# EAGLE schematic DNVT_box3rt (EAGLE 9.6.2)

## Sheet 1 of 3
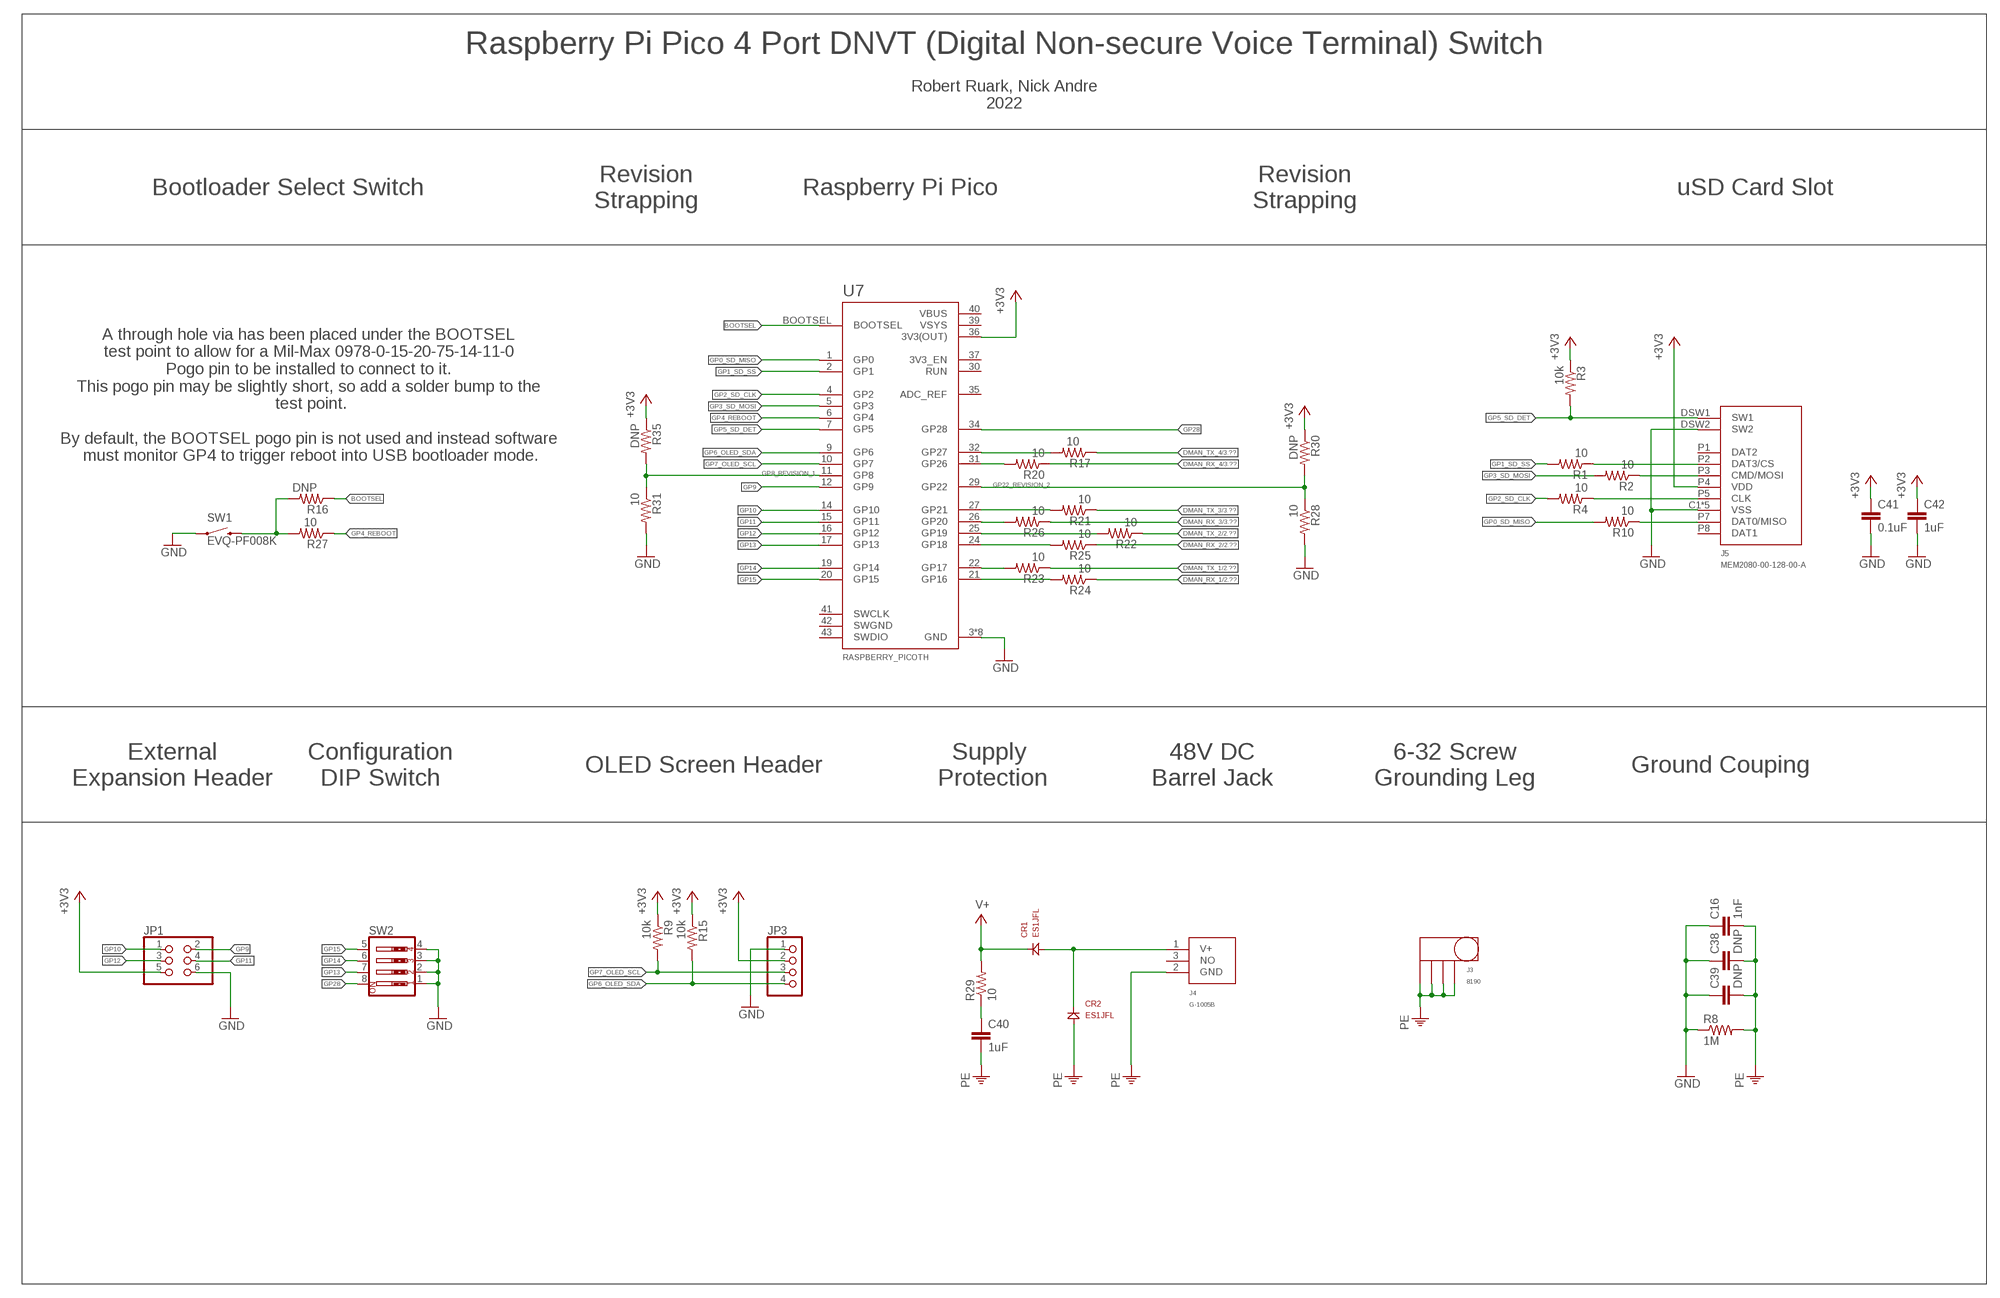
[diagram p0: schematic, sheet 1]

### Parts
C16  1nF  1206_CAPACITOR  [1206]
C38  DNP  1206_CAPACITOR  [1206]
C39  DNP  1206_CAPACITOR  [1206]
C40  1uF  1206_CAPACITOR  [1206]
C41  0.1uF  0603_CAPACITOR  [0603]
C42  1uF  0805_CAPACITOR  [0805]
CR1  ES1JFL  [SOD123(AK)]
CR2  ES1JFL  [SOD123(AK)]
J3  8190  [7781]
J4  G-1005B  [G-1005B]
J5  MEM2080-00-128-00-A  [MEM2080]
JP1  PINHD-2X3/90  [2X03/90]
JP3  PINHD-1X4  [1X04]
R1  10  0603_RESISTOR  [0603]
R2  10  0603_RESISTOR  [0603]
R3  10k  0603_RESISTOR  [0603]
R4  10  0603_RESISTOR  [0603]
R8  1M  1206_RESISTOR  [1206]
R9  10k  0603_RESISTOR  [0603]
R10  10  0603_RESISTOR  [0603]
R15  10k  0603_RESISTOR  [0603]
R16  DNP  0603_RESISTOR  [0603]
R17  10  0603_RESISTOR  [0603]
R20  10  0603_RESISTOR  [0603]
R21  10  0603_RESISTOR  [0603]
R22  10  0603_RESISTOR  [0603]
R23  10  0603_RESISTOR  [0603]
R24  10  0603_RESISTOR  [0603]
R25  10  0603_RESISTOR  [0603]
R26  10  0603_RESISTOR  [0603]
R27  10  0603_RESISTOR  [0603]
R28  10  0603_RESISTOR  [0603]
R29  10  1206_RESISTOR  [1206]
R30  DNP  0603_RESISTOR  [0603]
R31  10  0603_RESISTOR  [0603]
R35  DNP  0603_RESISTOR  [0603]
SW1  EVQ-PF008K  [EVQ-PF008K]
SW2  SW_DIP-4  [EDG-04]
U7  RASPBERRY_PICOTH  [PICO-PKG-TH]

### Nets
+3V3: C41.1 C42.1 J5.P4(VDD) JP1.5 JP3.2 R3.1 R9.1 R15.1 R30.1 R35.1 U7.36(3V3(OUT)) ; also sheet 2,3
BOOTSEL: R16.1 U7.BOOTSEL
DMAN_RX_1: R24.1 ; also sheet 2
DMAN_RX_2: R25.1 ; also sheet 2
DMAN_RX_3: R26.1 ; also sheet 3
DMAN_RX_4: R20.1 ; also sheet 3
DMAN_TX_1: R23.1 ; also sheet 2
DMAN_TX_2: R22.1 ; also sheet 2
DMAN_TX_3: R21.1 ; also sheet 3
DMAN_TX_4: R17.1 ; also sheet 3
GND: C16.1 C38.1 C39.1 C41.2 C42.2 J5.C1(VSS) J5.C2(VSS) J5.C3(VSS) J5.C4(VSS) J5.DSW2(SW2) J5.P6(VSS) JP1.6 JP3.1 R8.1 R28.2 R31.2 SW1.S1 SW2.1 SW2.2 SW2.3 SW2.4 U7.3(GND) U7.8(GND) U7.13(GND) U7.18(GND) U7.23(GND) U7.28(GND) U7.33(GND) U7.38(GND) ; also sheet 2,3
GP0_SD_MISO: R10.2 U7.1(GP0)
GP1_SD_SS: R1.2 U7.2(GP1)
GP2_SD_CLK: R4.2 U7.4(GP2)
GP3_SD_MOSI: R2.2 U7.5(GP3)
GP4_REBOOT: R27.1 U7.6(GP4)
GP5_SD_DET: J5.DSW1(SW1) R3.2 U7.7(GP5)
GP6_OLED_SDA: JP3.4 R15.2 U7.9(GP6)
GP7_OLED_SCL: JP3.3 R9.2 U7.10(GP7)
GP8_REVISION_1: R31.1 R35.2 U7.11(GP8)
GP9: JP1.2 U7.12(GP9)
GP10: JP1.1 U7.14(GP10)
GP11: JP1.4 U7.15(GP11)
GP12: JP1.3 U7.16(GP12)
GP13: SW2.7 U7.17(GP13)
GP14: SW2.6 U7.19(GP14)
GP15: SW2.5 U7.20(GP15)
GP22_REVISION_2: R28.1 R30.2 U7.29(GP22)
GP28: SW2.8 U7.34(GP28)
N$7: R20.2 U7.31(GP26)
N$13: R17.2 U7.32(GP27)
N$17: R24.2 U7.21(GP16)
N$18: R23.2 U7.22(GP17)
N$19: R16.2 R27.2 SW1.S2
N$20: CR1.A CR2.K J4.1(V+)
N$21: R25.2 U7.24(GP18)
N$22: R22.2 U7.25(GP19)
N$23: R21.2 U7.27(GP21)
N$24: R26.2 U7.26(GP20)
N$25: J5.P5(CLK) R4.1
N$27: C40.1 R29.1
N$28: J5.P7(DAT0/MISO) R10.1
N$30: J5.P3(CMD/MOSI) R2.1
N$31: J5.P2(DAT3/CS) R1.1
PE: C16.2 C38.2 C39.2 C40.2 CR2.A J3.P$1 J3.P$2 J3.P$3 J3.P$4 J4.2(GND) R8.2 ; also sheet 2,3
V+: CR1.K R29.2 ; also sheet 2,3
Unconnected: J4.3(NO) J5.P1(DAT2) J5.P8(DAT1) U7.30(RUN) U7.35(ADC_REF) U7.37(3V3_EN) U7.41(SWCLK) U7.43(SWDIO)

### Notes on the sheet
- Raspberry Pi Pico 4 Port DNVT (Digital Non-secure Voice Terminal) Switch
- Robert Ruark, Nick Andre
  2022
- Bootloader Select Switch
- Revision
  Strapping
- Raspberry Pi Pico
- Revision
  Strapping
- uSD Card Slot
- A through hole via has been placed under the BOOTSEL 
  test point to allow for a Mil-Max 0978-0-15-20-75-14-11-0 
  Pogo pin to be installed to connect to it. 
  This pogo pin may be slightly short, so add a solder bump to the 
  test point.
  
  By default, the BOOTSEL pogo pin is not used and instead software 
  must monitor GP4 to trigger reboot into USB bootloader mode.
- External
  Expansion Header
- Configuration
  DIP Switch
- OLED Screen Header
- Supply 
  Protection
- 48V DC
  Barrel Jack
- 6-32 Screw
  Grounding Leg
- Ground Couping

## Sheet 2 of 3
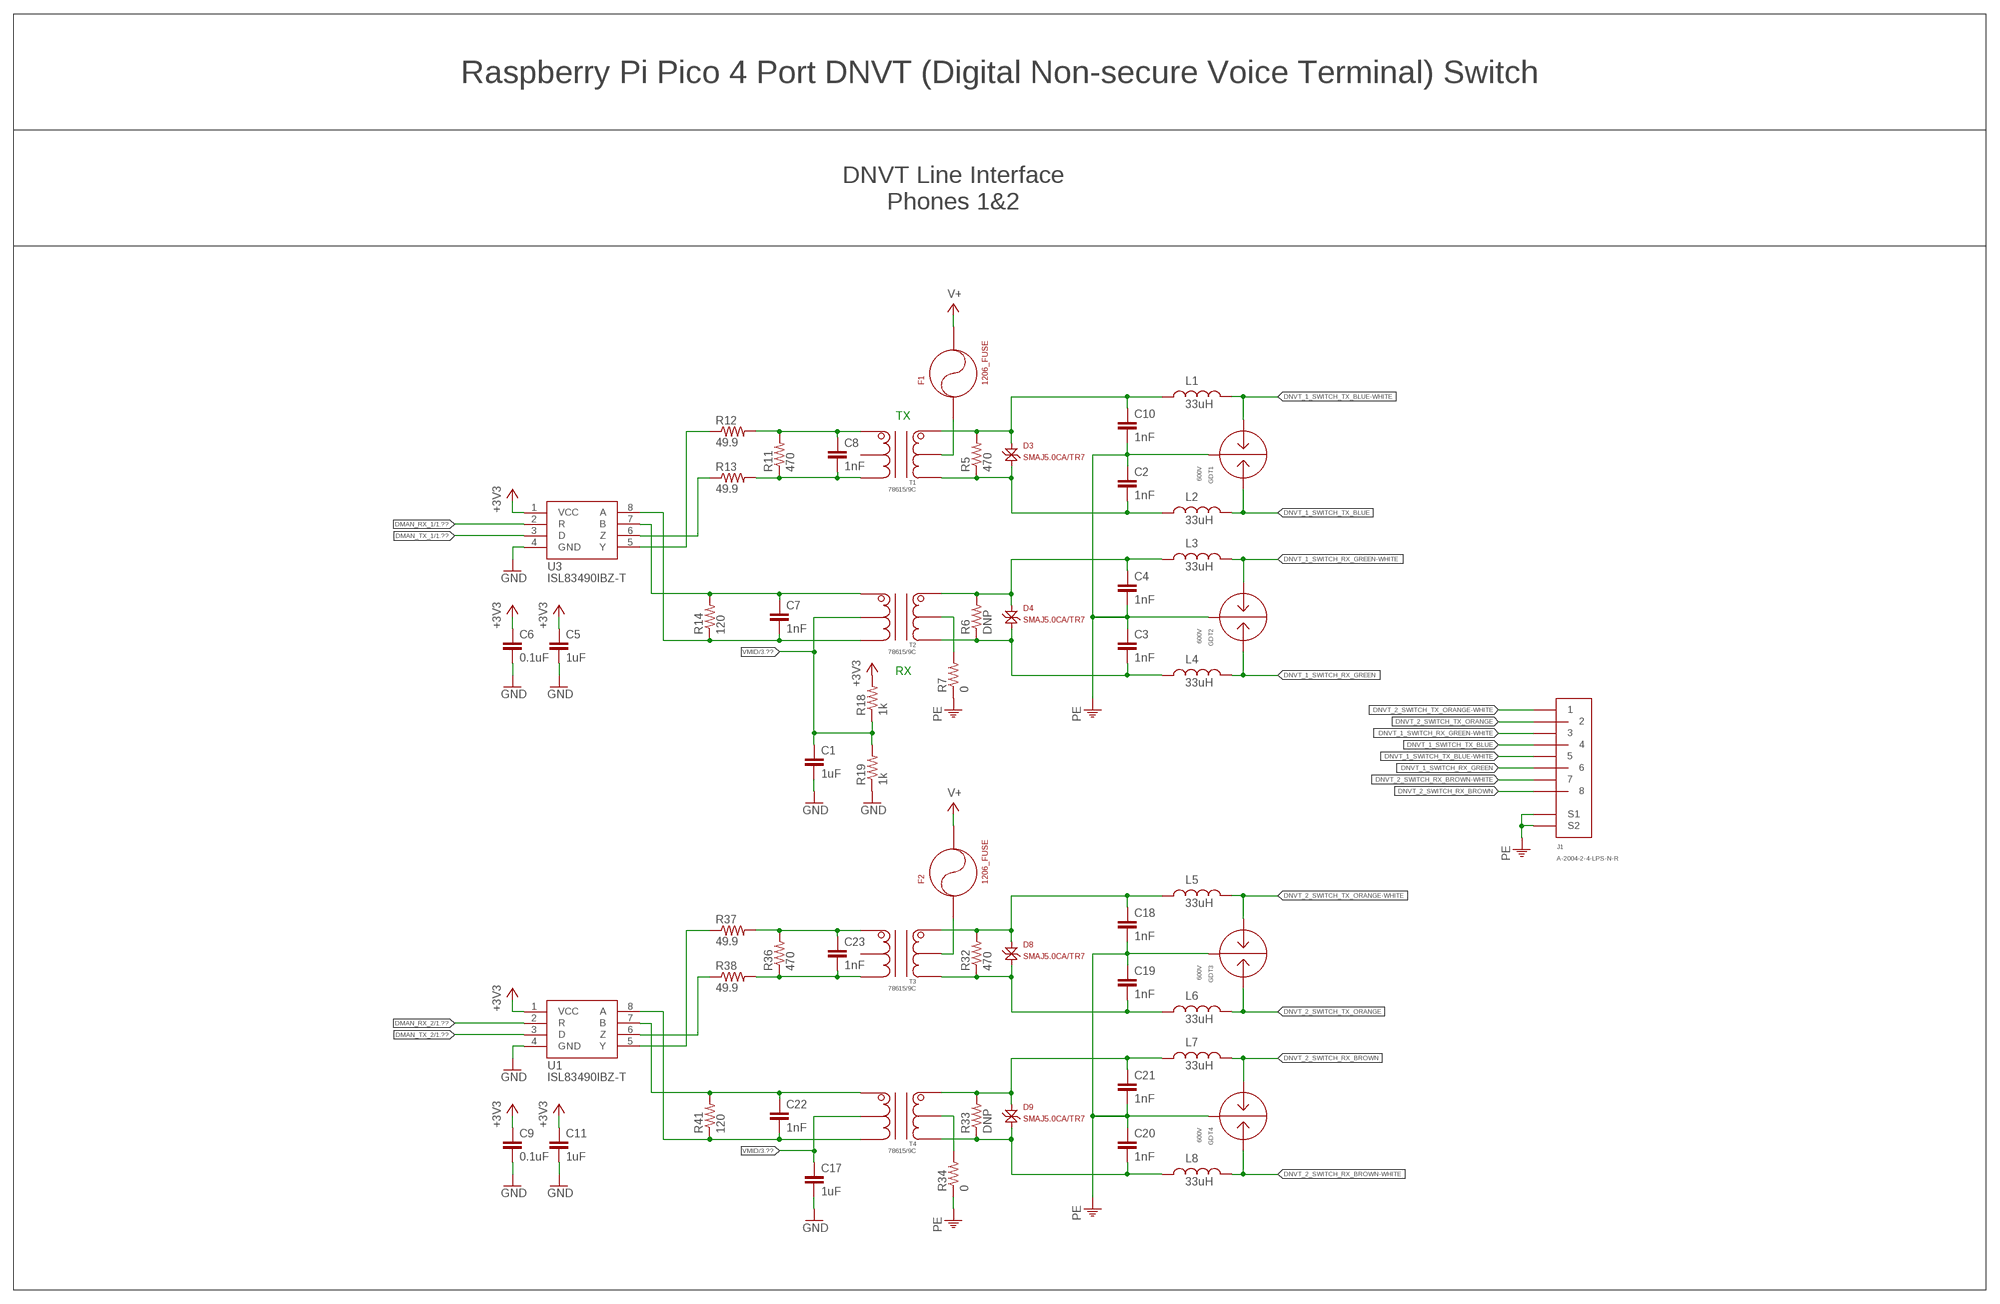
[diagram p1: schematic, sheet 2]

### Parts
C1  1uF  0805_CAPACITOR  [0805]
C2  1nF  0805_CAPACITOR  [0805]
C3  1nF  0805_CAPACITOR  [0805]
C4  1nF  0805_CAPACITOR  [0805]
C5  1uF  0805_CAPACITOR  [0805]
C6  0.1uF  0603_CAPACITOR  [0603]
C7  1nF  0805_CAPACITOR  [0805]
C8  1nF  0805_CAPACITOR  [0805]
C9  0.1uF  0603_CAPACITOR  [0603]
C10  1nF  0805_CAPACITOR  [0805]
C11  1uF  0805_CAPACITOR  [0805]
C17  1uF  0805_CAPACITOR  [0805]
C18  1nF  0805_CAPACITOR  [0805]
C19  1nF  0805_CAPACITOR  [0805]
C20  1nF  0805_CAPACITOR  [0805]
C21  1nF  0805_CAPACITOR  [0805]
C22  1nF  0805_CAPACITOR  [0805]
C23  1nF  0805_CAPACITOR  [0805]
D3  SMAJ5.0CA/TR7  [DO-214AC_NO_POL]
D4  SMAJ5.0CA/TR7  [DO-214AC_NO_POL]
D8  SMAJ5.0CA/TR7  [DO-214AC_NO_POL]
D9  SMAJ5.0CA/TR7  [DO-214AC_NO_POL]
F1  1206_FUSE  [1206]
F2  1206_FUSE  [1206]
GDT1  600V  2036-60-SM-RPLF  [2036_GDT]
GDT2  600V  2036-60-SM-RPLF  [2036_GDT]
GDT3  600V  2036-60-SM-RPLF  [2036_GDT]
GDT4  600V  2036-60-SM-RPLF  [2036_GDT]
J1  A-2004-2-4-LPS-N-R  [A-2004-2-4-LPS-N-R]
L1  33uH  SDR0403-330KL  [SDR0403]
L2  33uH  SDR0403-330KL  [SDR0403]
L3  33uH  SDR0403-330KL  [SDR0403]
L4  33uH  SDR0403-330KL  [SDR0403]
L5  33uH  SDR0403-330KL  [SDR0403]
L6  33uH  SDR0403-330KL  [SDR0403]
L7  33uH  SDR0403-330KL  [SDR0403]
L8  33uH  SDR0403-330KL  [SDR0403]
R5  470  R-US_R0805  [R0805]
R6  DNP  R-US_R0805  [R0805]
R7  0  R-US_R0805  [R0805]
R11  470  R-US_R0805  [R0805]
R12  49.9  R-US_R0805  [R0805]
R13  49.9  R-US_R0805  [R0805]
R14  120  1206_RESISTOR  [1206]
R18  1k  0603_RESISTOR  [0603]
R19  1k  0603_RESISTOR  [0603]
R32  470  R-US_R0805  [R0805]
R33  DNP  R-US_R0805  [R0805]
R34  0  R-US_R0805  [R0805]
R36  470  R-US_R0805  [R0805]
R37  49.9  R-US_R0805  [R0805]
R38  49.9  R-US_R0805  [R0805]
R41  120  1206_RESISTOR  [1206]
T1  78615/9C  [786T]
T2  78615/9C  [786T]
T3  78615/9C  [786T]
T4  78615/9C  [786T]
U1  ISL83490IBZ-T  [SOIC8]
U3  ISL83490IBZ-T  [SOIC8]

### Nets
+3V3: C5.1 C6.1 C9.1 C11.1 R18.2 U1.1(VCC) U3.1(VCC) ; also sheet 1,3
DMAN_RX_1: U3.2(R) ; also sheet 1
DMAN_RX_2: U1.2(R) ; also sheet 1
DMAN_TX_1: U3.3(D) ; also sheet 1
DMAN_TX_2: U1.3(D) ; also sheet 1
DNVT_1_SWITCH_RX_GREEN: GDT2.L2 J1.6 L4.2
DNVT_1_SWITCH_RX_GREEN-WHITE: GDT2.L1 J1.3 L3.2
DNVT_1_SWITCH_TX_BLUE: GDT1.L2 J1.4 L2.2
DNVT_1_SWITCH_TX_BLUE-WHITE: GDT1.L1 J1.5 L1.2
DNVT_2_SWITCH_RX_BROWN: GDT4.L1 J1.8 L7.2
DNVT_2_SWITCH_RX_BROWN-WHITE: GDT4.L2 J1.7 L8.2
DNVT_2_SWITCH_TX_ORANGE: GDT3.L2 J1.2 L6.2
DNVT_2_SWITCH_TX_ORANGE-WHITE: GDT3.L1 J1.1 L5.2
GND: C1.2 C5.2 C6.2 C9.2 C11.2 C17.2 R19.1 U1.4(GND) U3.4(GND) ; also sheet 1,3
N$1: C10.1 D3.C(K) L1.1 R5.2 T1.1
N$2: C2.2 D3.A L2.1 R5.1 T1.3
N$3: C4.1 D4.C(K) L3.1 R6.2 T2.1
N$4: C3.2 D4.A L4.1 R6.1 T2.3
N$5: R7.2 T2.2
N$6: F1.1 T1.2
N$8: C22.1 R41.2 T4.6 U1.7(B)
N$9: C7.1 R14.2 T2.6 U3.7(B)
N$10: C7.2 R14.1 T2.4 U3.8(A)
N$11: C8.2 R11.1 R13.2 T1.4
N$12: C8.1 R11.2 R12.2 T1.6
N$14: R12.1 U3.5(Y)
N$16: R13.1 U3.6(Z)
N$44: C22.2 R41.1 T4.4 U1.8(A)
N$63: C18.1 D8.C(K) L5.1 R32.2 T3.1
N$64: C19.2 D8.A L6.1 R32.1 T3.3
N$65: C21.1 D9.C(K) L7.1 R33.2 T4.1
N$66: C20.2 D9.A L8.1 R33.1 T4.3
N$67: R34.2 T4.2
N$68: F2.1 T3.2
N$71: C23.1 R36.2 R37.2 T3.6
N$72: R37.1 U1.5(Y)
N$73: R38.1 U1.6(Z)
N$79: C23.2 R36.1 R38.2 T3.4
PE: C2.1 C3.1 C4.2 C10.2 C18.2 C19.1 C20.1 C21.2 GDT1.C GDT2.C GDT3.C GDT4.C J1.S1 J1.S2 R7.1 R34.1 ; also sheet 1,3
V+: F1.2 F2.2 ; also sheet 1,3
VMID: C1.1 C17.1 R18.1 R19.2 T2.5 T4.5 ; also sheet 3
Unconnected: T1.5 T3.5

### Notes on the sheet
- Raspberry Pi Pico 4 Port DNVT (Digital Non-secure Voice Terminal) Switch
- DNVT Line Interface
  Phones 1&2
- TX
- RX

## Sheet 3 of 3
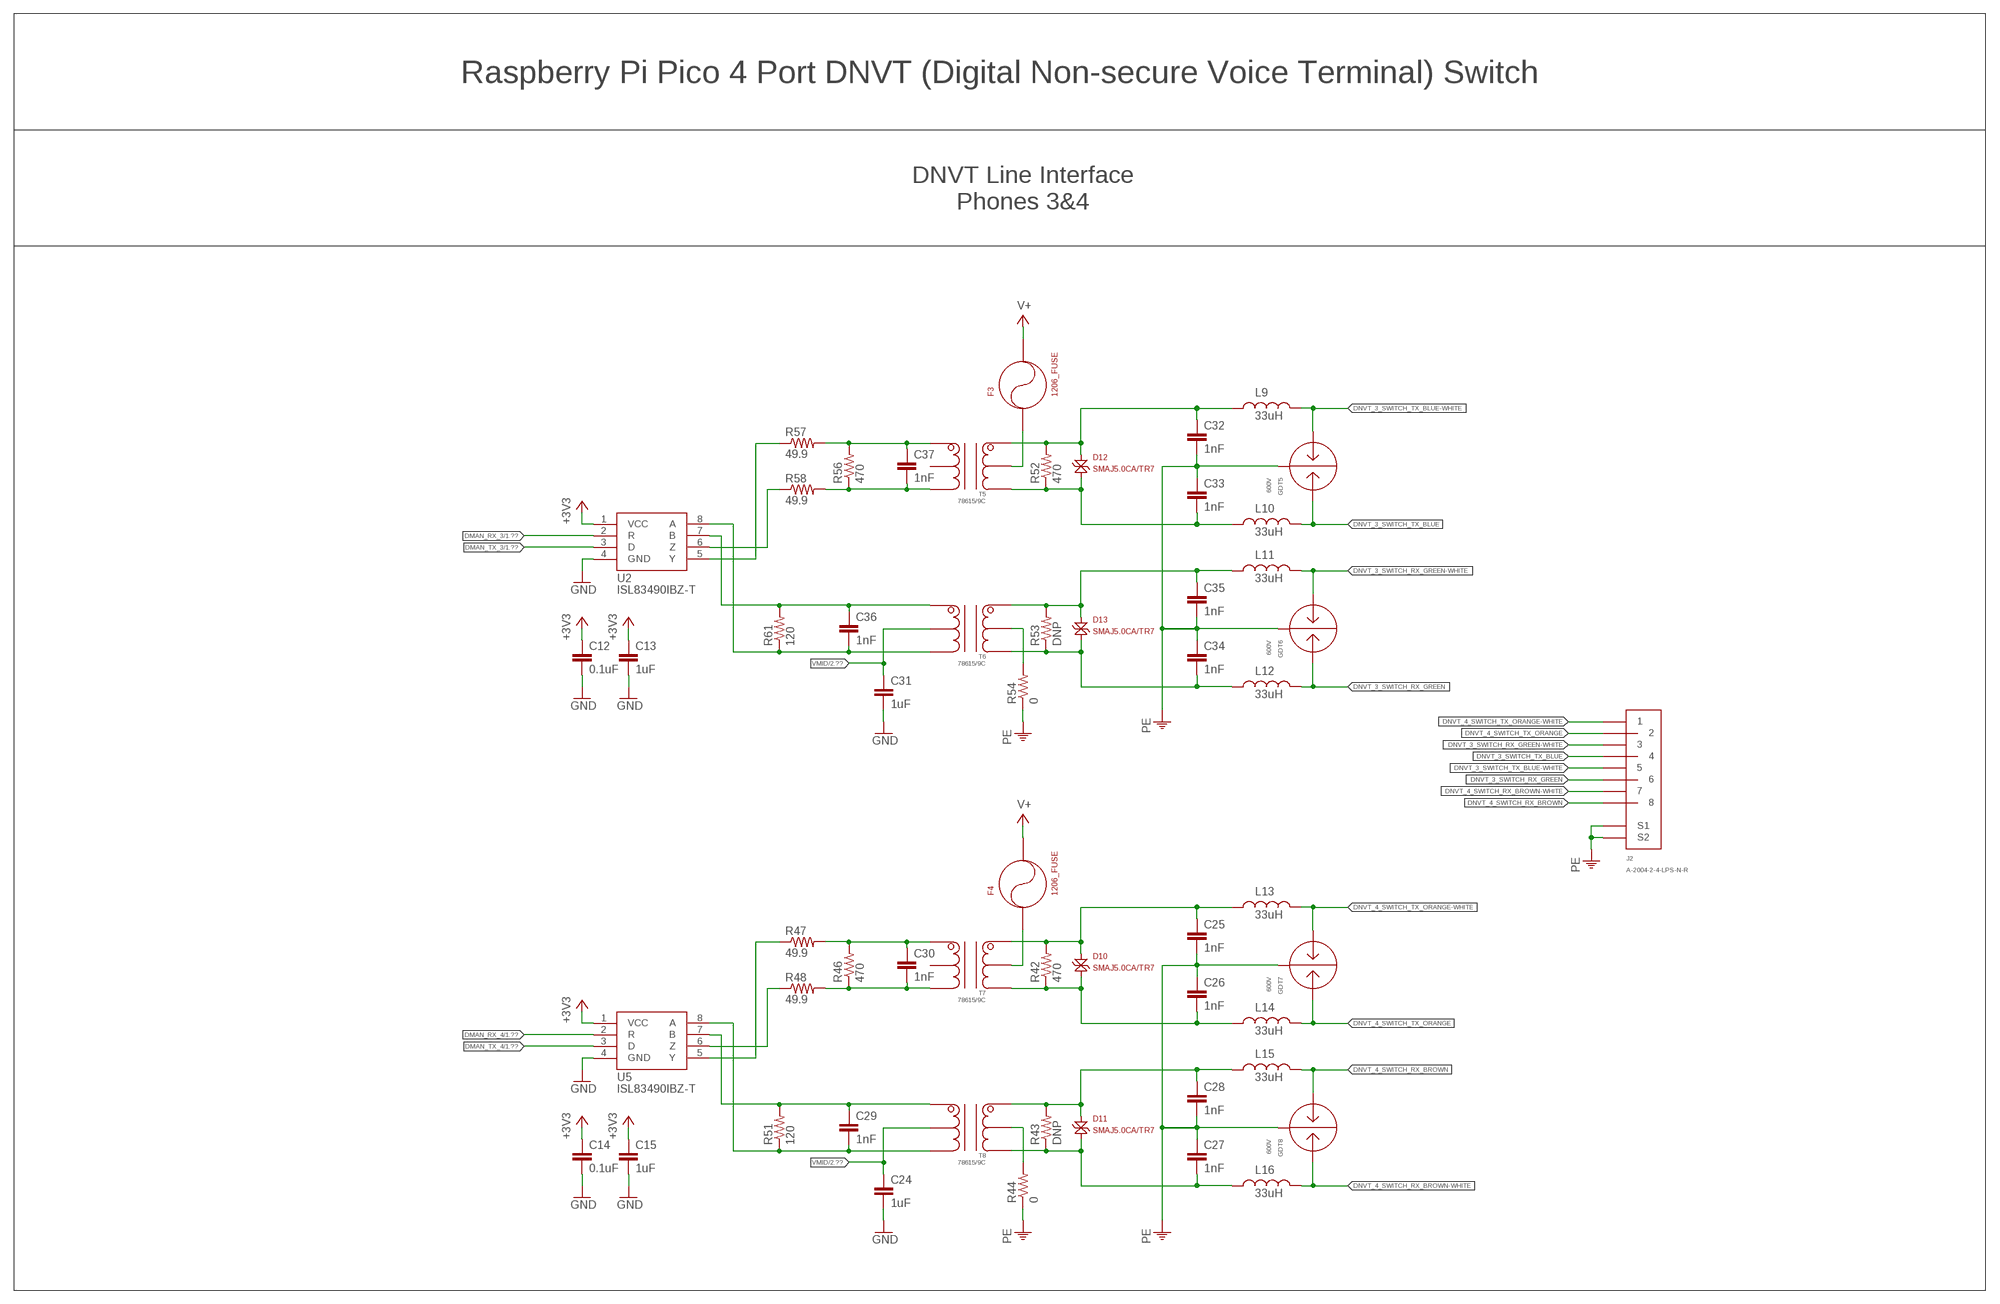
[diagram p2: schematic, sheet 3]

### Parts
C12  0.1uF  0603_CAPACITOR  [0603]
C13  1uF  0805_CAPACITOR  [0805]
C14  0.1uF  0603_CAPACITOR  [0603]
C15  1uF  0805_CAPACITOR  [0805]
C24  1uF  0805_CAPACITOR  [0805]
C25  1nF  0805_CAPACITOR  [0805]
C26  1nF  0805_CAPACITOR  [0805]
C27  1nF  0805_CAPACITOR  [0805]
C28  1nF  0805_CAPACITOR  [0805]
C29  1nF  0805_CAPACITOR  [0805]
C30  1nF  0805_CAPACITOR  [0805]
C31  1uF  0805_CAPACITOR  [0805]
C32  1nF  0805_CAPACITOR  [0805]
C33  1nF  0805_CAPACITOR  [0805]
C34  1nF  0805_CAPACITOR  [0805]
C35  1nF  0805_CAPACITOR  [0805]
C36  1nF  0805_CAPACITOR  [0805]
C37  1nF  0805_CAPACITOR  [0805]
D10  SMAJ5.0CA/TR7  [DO-214AC_NO_POL]
D11  SMAJ5.0CA/TR7  [DO-214AC_NO_POL]
D12  SMAJ5.0CA/TR7  [DO-214AC_NO_POL]
D13  SMAJ5.0CA/TR7  [DO-214AC_NO_POL]
F3  1206_FUSE  [1206]
F4  1206_FUSE  [1206]
GDT5  600V  2036-60-SM-RPLF  [2036_GDT]
GDT6  600V  2036-60-SM-RPLF  [2036_GDT]
GDT7  600V  2036-60-SM-RPLF  [2036_GDT]
GDT8  600V  2036-60-SM-RPLF  [2036_GDT]
J2  A-2004-2-4-LPS-N-R  [A-2004-2-4-LPS-N-R]
L9  33uH  SDR0403-330KL  [SDR0403]
L10  33uH  SDR0403-330KL  [SDR0403]
L11  33uH  SDR0403-330KL  [SDR0403]
L12  33uH  SDR0403-330KL  [SDR0403]
L13  33uH  SDR0403-330KL  [SDR0403]
L14  33uH  SDR0403-330KL  [SDR0403]
L15  33uH  SDR0403-330KL  [SDR0403]
L16  33uH  SDR0403-330KL  [SDR0403]
R42  470  R-US_R0805  [R0805]
R43  DNP  R-US_R0805  [R0805]
R44  0  R-US_R0805  [R0805]
R46  470  R-US_R0805  [R0805]
R47  49.9  R-US_R0805  [R0805]
R48  49.9  R-US_R0805  [R0805]
R51  120  1206_RESISTOR  [1206]
R52  470  R-US_R0805  [R0805]
R53  DNP  R-US_R0805  [R0805]
R54  0  R-US_R0805  [R0805]
R56  470  R-US_R0805  [R0805]
R57  49.9  R-US_R0805  [R0805]
R58  49.9  R-US_R0805  [R0805]
R61  120  1206_RESISTOR  [1206]
T5  78615/9C  [786T]
T6  78615/9C  [786T]
T7  78615/9C  [786T]
T8  78615/9C  [786T]
U2  ISL83490IBZ-T  [SOIC8]
U5  ISL83490IBZ-T  [SOIC8]

### Nets
+3V3: C12.1 C13.1 C14.1 C15.1 U2.1(VCC) U5.1(VCC) ; also sheet 1,2
DMAN_RX_3: U2.2(R) ; also sheet 1
DMAN_RX_4: U5.2(R) ; also sheet 1
DMAN_TX_3: U2.3(D) ; also sheet 1
DMAN_TX_4: U5.3(D) ; also sheet 1
DNVT_3_SWITCH_RX_GREEN: GDT6.L2 J2.6 L12.2
DNVT_3_SWITCH_RX_GREEN-WHITE: GDT6.L1 J2.3 L11.2
DNVT_3_SWITCH_TX_BLUE: GDT5.L2 J2.4 L10.2
DNVT_3_SWITCH_TX_BLUE-WHITE: GDT5.L1 J2.5 L9.2
DNVT_4_SWITCH_RX_BROWN: GDT8.L1 J2.8 L15.2
DNVT_4_SWITCH_RX_BROWN-WHITE: GDT8.L2 J2.7 L16.2
DNVT_4_SWITCH_TX_ORANGE: GDT7.L2 J2.2 L14.2
DNVT_4_SWITCH_TX_ORANGE-WHITE: GDT7.L1 J2.1 L13.2
GND: C12.2 C13.2 C14.2 C15.2 C24.2 C31.2 U2.4(GND) U5.4(GND) ; also sheet 1,2
N$45: C36.1 R61.2 T6.6 U2.7(B)
N$52: C36.2 R61.1 T6.4 U2.8(A)
N$81: C25.1 D10.C(K) L13.1 R42.2 T7.1
N$82: C26.2 D10.A L14.1 R42.1 T7.3
N$83: C28.1 D11.C(K) L15.1 R43.2 T8.1
N$84: C27.2 D11.A L16.1 R43.1 T8.3
N$85: R44.2 T8.2
N$86: F4.1 T7.2
N$88: C29.1 R51.2 T8.6 U5.7(B)
N$89: C30.1 R46.2 R47.2 T7.6
N$90: R47.1 U5.5(Y)
N$91: R48.1 U5.6(Z)
N$97: C30.2 R46.1 R48.2 T7.4
N$98: C29.2 R51.1 T8.4 U5.8(A)
N$99: C32.1 D12.C(K) L9.1 R52.2 T5.1
N$100: C33.2 D12.A L10.1 R52.1 T5.3
N$101: C35.1 D13.C(K) L11.1 R53.2 T6.1
N$102: C34.2 D13.A L12.1 R53.1 T6.3
N$103: R54.2 T6.2
N$104: F3.1 T5.2
N$107: C37.1 R56.2 R57.2 T5.6
N$108: R57.1 U2.5(Y)
N$109: R58.1 U2.6(Z)
N$115: C37.2 R56.1 R58.2 T5.4
PE: C25.2 C26.1 C27.1 C28.2 C32.2 C33.1 C34.1 C35.2 GDT5.C GDT6.C GDT7.C GDT8.C J2.S1 J2.S2 R44.1 R54.1 ; also sheet 1,2
V+: F3.2 F4.2 ; also sheet 1,2
VMID: C24.1 C31.1 T6.5 T8.5 ; also sheet 2
Unconnected: T5.5 T7.5

### Notes on the sheet
- Raspberry Pi Pico 4 Port DNVT (Digital Non-secure Voice Terminal) Switch
- DNVT Line Interface
  Phones 3&4

## Power pins joined to a net without a drawn wire
SWGND: U7.42(SWGND)
VBUS: U7.40(VBUS)
VSYS: U7.39(VSYS)

## Library data of the parts
C1-C5 C7 C8 C10 C11 C13 C15 C17-C37 C42 = ruark2:0805_CAPACITOR: NO DEFINED PN
C6 C9 C12 C14 C41 = ruark2:0603_CAPACITOR: 0603 Capacitor -- WARNING: NO DEFINED VALUE OR PART NUMBER; VALUE: sel
C16 C38-C40 = ruark2:1206_CAPACITOR: NO DEFINED PN; VALUE: sel
CR1 CR2 = ruark2:ES1JFL: Diode Standard 600 V 1A Surface Mount SOD-123F; PARTNO: ES1JFLCT-ND
D3 D4 D8-D13 = ruark2:SMAJ5.0CA/TR7: 9.2V Clamp 43.5A Ipp Tvs Diode Surface Mount DO-214AC (SMA)
F1-F4 = ruark2:1206_FUSE
GDT1-GDT8 = ruark2:2036-60-SM-RPLF: Gas Discharge Tube 600 V 10000A (10kA) ±20% 3 Pole Surface Mount LCSC Knockoff SE90-600X; PARTNO: 2036-60-SM-RPLFCT-ND
J1 J2 = ruark2:A-2004-2-4-LPS-N-R: Jack Modular Connector 8p8c (RJ45, Ethernet) 90° Angle (Right) Shielded Asian alternate: RCH RC00994; PARTNO: AE10387-ND
J3 = ruark2:8190: 4 Pin Screw Terminal, Power Tap 6-32 Through Hole, Right Angle; PARTNO: 36-8190-ND
J4 = ruark2:G-1005B: Power Barrel Connector Jack 2.50mm ID (0.098"), 5.50mm OD (0.217") Through Hole, Right Angle; PARTNO: 1939-G-1005B-ND
J5 = ruark2:MEM2080-00-128-00-A: 9 (8 + 1) Position Card Connector Secure Digital - microSD™ Surface Mount, Right Angle Gold; PARTNO: 2073-MEM2080-00-128-00-ACT-ND
JP1 = pinhead:PINHD-2X3: PIN HEADER
JP3 = pinhead:PINHD-1X4: PIN HEADER
L1-L16 = ruark2:SDR0403-330KL: 33 µH Unshielded Drum Core, Wirewound Inductor 640 mA 540mOhm Max Nonstandard LCSC knockoff: SM4532-330MT; PARTNO: SDR0403-330KLCT-ND
R1-R4 R9 R10 R15-R28 R30 R31 R35 = ruark2:0603_RESISTOR: 0603 Resistor -- WARNING: NO DEFINED PART NUMBER OR VALUE; VALUE: sel
R5-R7 R11-R13 R32-R34 R36-R38 R42-R44 R46-R48 R52-R54 R56-R58 = rcl:R-US_: RESISTOR, American symbol; SPICEPREFIX: R
R8 R14 R29 R41 R51 R61 = ruark2:1206_RESISTOR: NO DEFINED PN; VALUE: sel
SW1 = ruark2:EVQ-PF008K: Tactile Switch SPST-NO Side Actuated Through Hole, Right Angle; PARTNO: P10880S-ND
SW2 = special:SW_DIP-4: DIP SWITCH
T1-T8 = ruark2:78615/9C: 10mH General Purpose Pulse Transformer 1CT:1CT Surface Mount 56Vus
U1-U3 U5 = ruark2:ISL83490IBZ-T: 1/1 Transceiver Full RS422, RS485 8-SOIC 3.3V; PARTNO: ISL83490IBZ-TCT-ND
U7 = ruark2:RASPBERRY_PICO: Raspberry Pi Pico

## Net classes
1 HV: clearance 0.406 mm